# EAGLE design shinobi_BLE_Rev010001 (EAGLE 9.6.2)
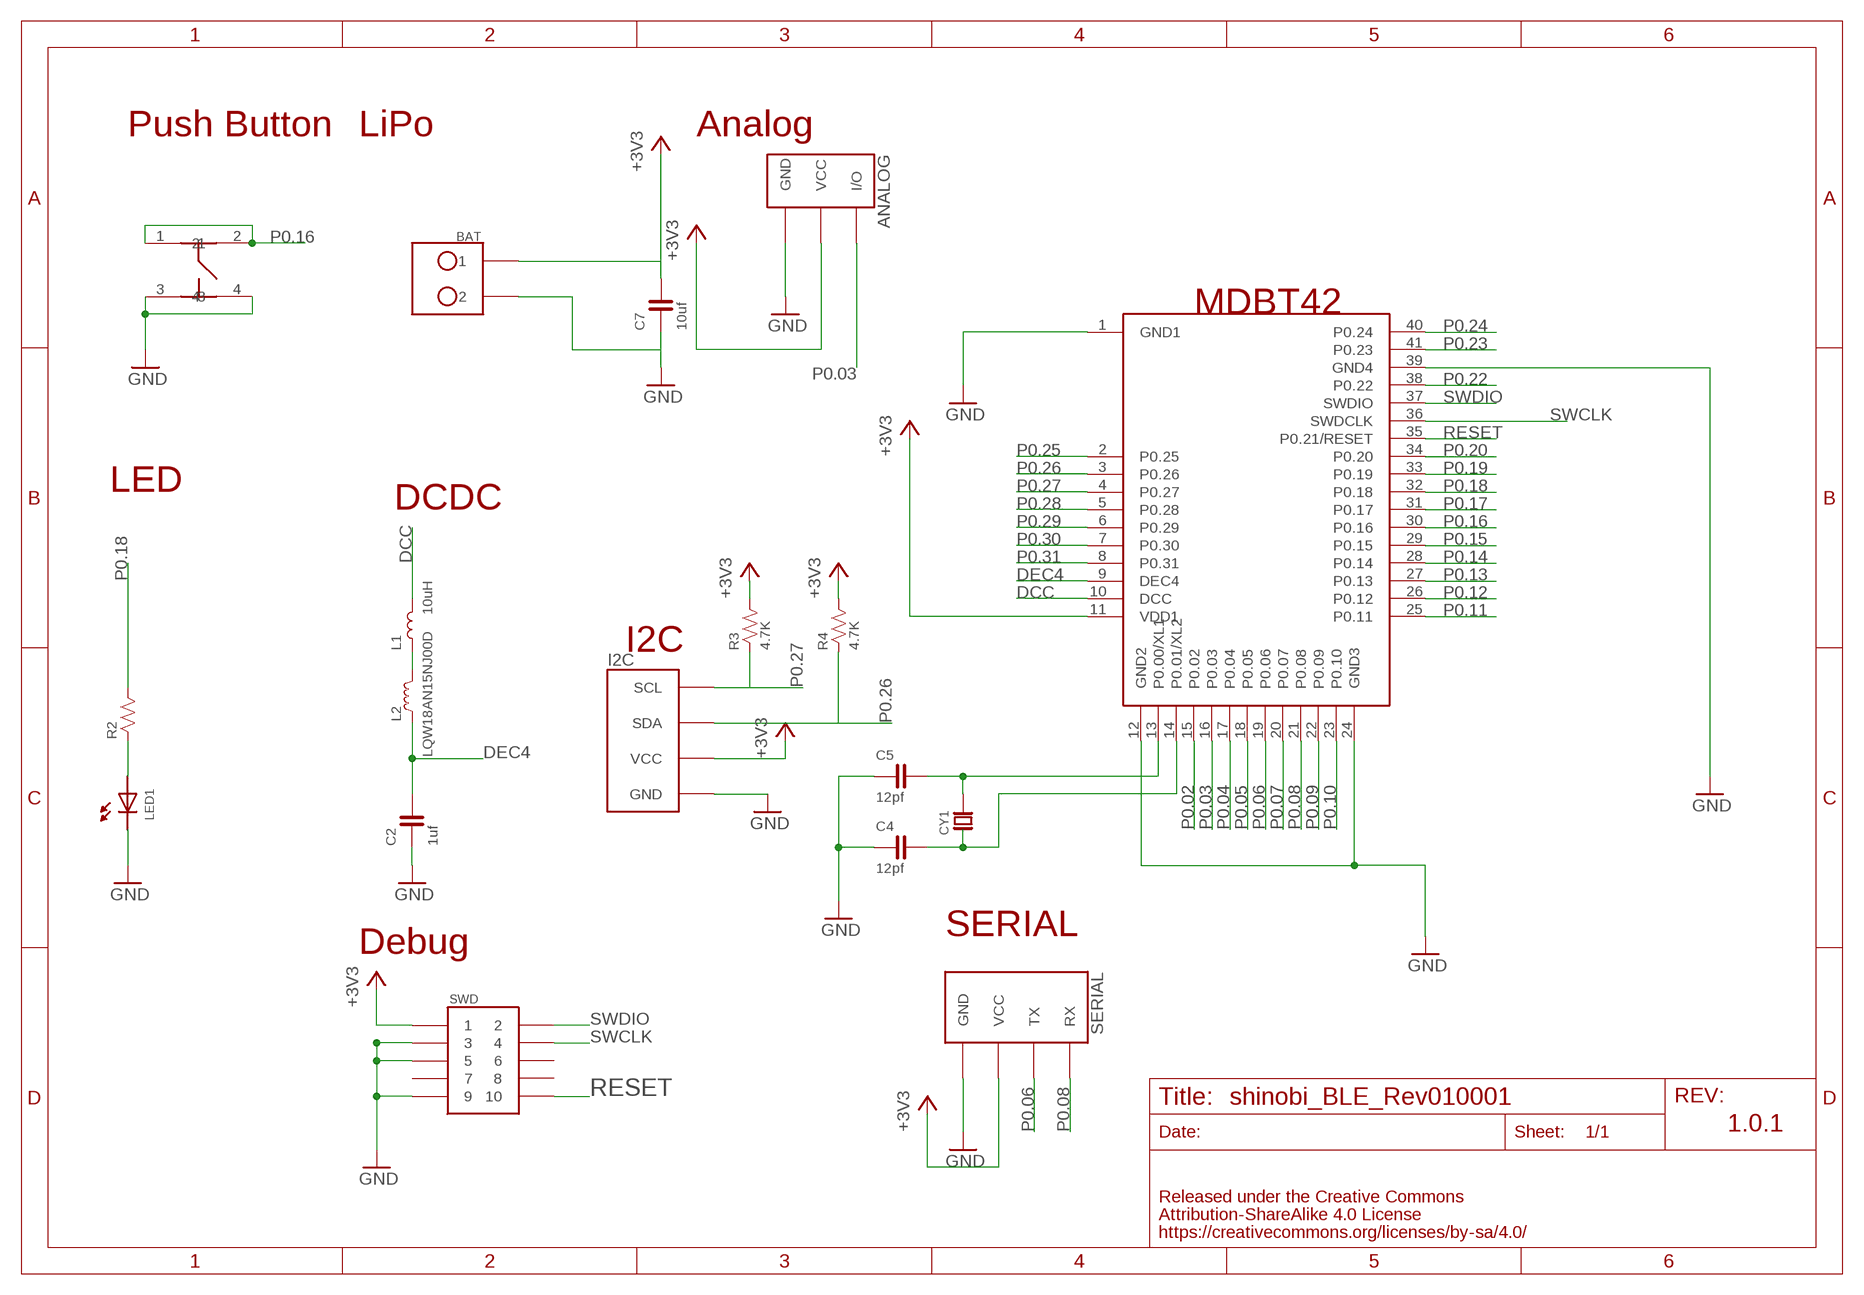
[diagram p0: schematic, sheet 1]

## Parts
ANALOG  FABO_BRICK_3PIN-S03B-PASK-2_LONG  [FABO_BRICK_3PIN_S03B-PASK-2_LONG]
BAT  S2B-PH-SM4_TB  [S2B-PH-SM4-TB]
C2  1uf  CAPACITOR-0603  [0603]
C4  12pf  CAPACITOR-0603  [0603]
C5  12pf  CAPACITOR-0603  [0603]
C7  10uf  CAPACITOR-0603  [0603]
CY1  CRYSTAL-ABS07  [ABRACON-ABS07-32.768KHZ]
I2C  FABO_BRICK_I2C-S04B-PASK-2_LONG  [FABO_BRICK_I2C_S04B-PASK-2_LONG]
L1  10uH  INDUCTOR-0603  [0603]
L2  LQW18AN15NJ00D  [0603]
LED1  LED-0603  [0603]
R2  RESISTOR-0603  [0603]
R3  4.7K  RESISTOR-0603  [0603]
R4  4.7K  RESISTOR-0603  [0603]
SERIAL  FABO_BRICK_SERIAL-S04B-PASK-2_LONG  [FABO_BRICK_SERIAL_S04B-PASK-2_LONG]
SWD  PIN-HEADER-SMT(1.27MM)2X5  [PIN-HEADER-SMT(1.27MM)2X5]
U$2  RAYTAC-MDBT42  [RAYTAC-MDBT42]
U$5  SWICTH-4P(KMR2)  [SWITCH-4P(KMR2)]

## Nets
+3V3: ANALOG.VCC BAT.2 C7.2 I2C.VCC R3.2 R4.2 SERIAL.VCC SWD.1 U$2.11(VDD1)
DCC: L1.2 U$2.10(DCC)
DEC4: C2.2 L2.1 U$2.9(DEC4)
GND: ANALOG.GND BAT.1 C2.1 C4.1 C5.1 C7.1 I2C.GND LED1.CATHODE SERIAL.GND SWD.3 SWD.5 SWD.9 U$2.1(GND1) U$2.12(GND2) U$2.24(GND3) U$2.39(GND4) U$5.3 U$5.4
N$1: LED1.ANODE R2.1
N$2: L1.1 L2.2
N$7: C5.2 CY1.P$2 U$2.13(P0.00/XL1)
N$8: C4.2 CY1.P$1 U$2.14(P0.01/XL2)
P0.02: U$2.15(P0.02)
P0.03: ANALOG.I/O U$2.16(P0.03)
P0.04: U$2.17(P0.04)
P0.05: U$2.18(P0.05)
P0.06: SERIAL.TX U$2.19(P0.06)
P0.07: U$2.20(P0.07)
P0.08: SERIAL.RX U$2.21(P0.08)
P0.09: U$2.22(P0.09)
P0.10: U$2.23(P0.10)
P0.11: U$2.25(P0.11)
P0.12: U$2.26(P0.12)
P0.13: U$2.27(P0.13)
P0.14: U$2.28(P0.14)
P0.15: U$2.29(P0.15)
P0.16: U$2.30(P0.16) U$5.1 U$5.2
P0.17: U$2.31(P0.17)
P0.18: R2.2 U$2.32(P0.18)
P0.19: U$2.33(P0.19)
P0.20: U$2.34(P0.20)
P0.22: U$2.38(P0.22)
P0.23: U$2.41(P0.23)
P0.24: U$2.40(P0.24)
P0.25: U$2.2(P0.25)
P0.26: I2C.SDA R4.1 U$2.3(P0.26)
P0.27: I2C.SCL R3.1 U$2.4(P0.27)
P0.28: U$2.5(P0.28)
P0.29: U$2.6(P0.29)
P0.30: U$2.7(P0.30)
P0.31: U$2.8(P0.31)
RESET: SWD.10 U$2.35(P0.21/RESET)
SWCLK: SWD.4 U$2.36(SWDCLK)
SWDIO: SWD.2 U$2.37(SWDIO)
Unconnected: SWD.6 SWD.7 SWD.8

## Notes on the sheet
- Push Button | LiPo | Analog
- MDBT42
- LED
- DCDC
- I2C
- SERIAL
- Debug
- 1.0.1

## Library data of the parts
ANALOG = FaBo-Template:FABO_BRICK_3PIN: FaBo Brick 3pin
BAT = FaBo-Connetor:S2B-PH-SM4_TB
C2 C4 C5 C7 = FaBo-Capacitor:CAPACITOR: CAPACITOR
CY1 = FaBo-Crystal:CRYSTAL
I2C = FaBo-Template:FABO_BRICK_I2C: FaBo Brick I2C
L1 = FaBo-Inductor:INDUCTOR: RESISTOR
L2 = FaBo-Coil:LQW18AN15NJ00D
LED1 = FaBo-LED:LED
R2-R4 = FaBo-Resistors:RESISTOR: RESISTOR
SERIAL = FaBo-Template:FABO_BRICK_SERIAL: FaBo Brick Serial
SWD = FaBo-PIN:PIN-HEADER-SMT(1.27MM)2X5
U$2 = FaBo-BT:RAYTAC-MDBT42
U$5 = gclue-test:SWICTH-4P(KMR2)

## Board
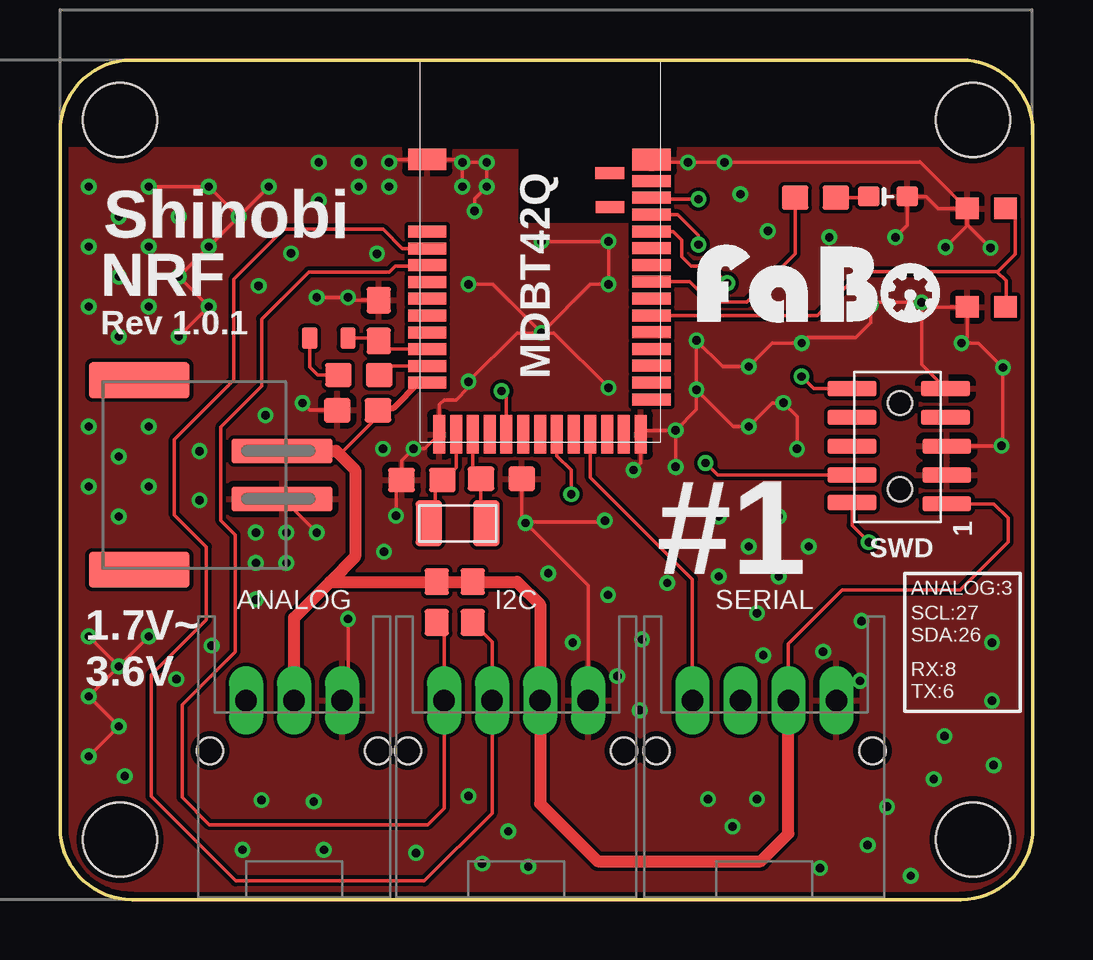
[diagram p1: board, top side]
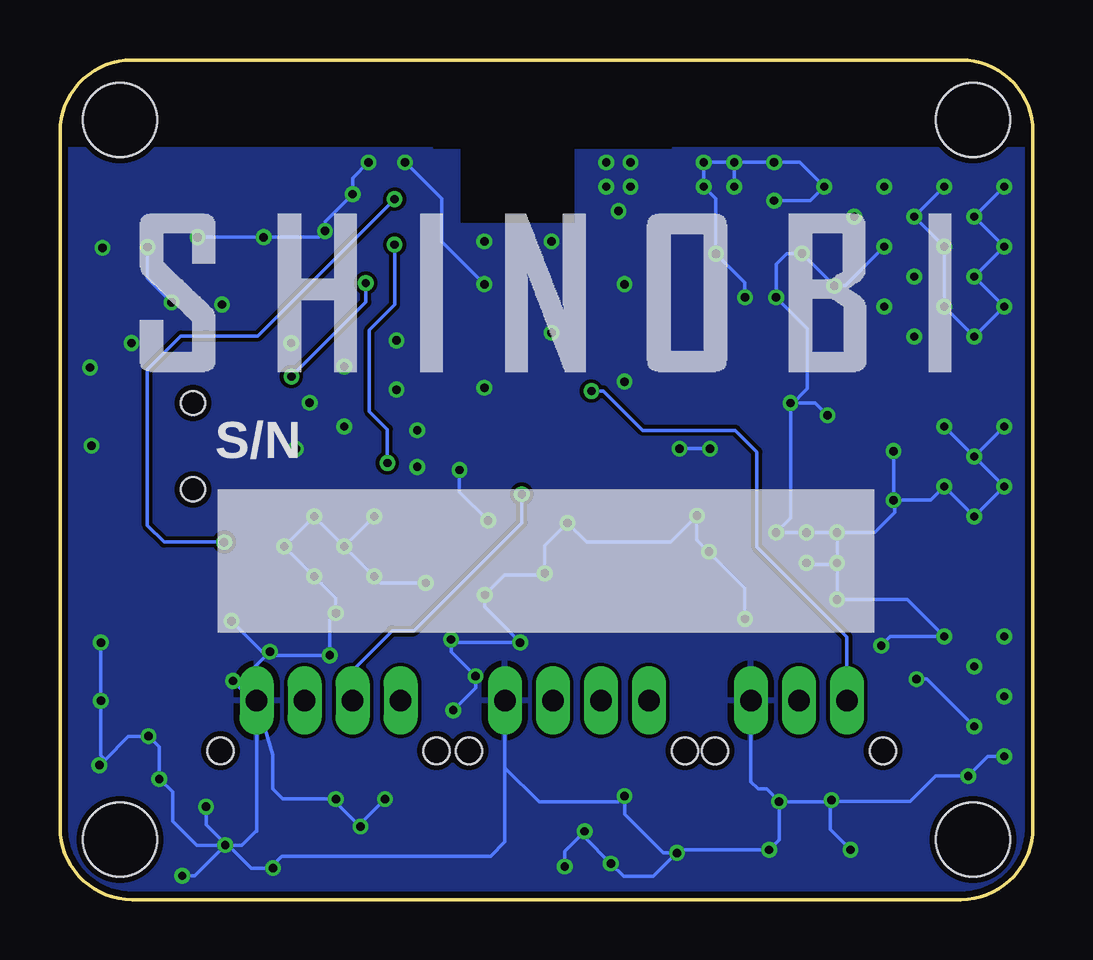
[diagram p2: board, bottom side, seen from below]

Size 40.54 x 35 mm. Coordinates in mm from the lower left corner, seen from the top.
Copper layers (1*16): Top 0.035mm / dielectric 1.5mm / Bottom 0.035mm
Design rules "SeeedStudio_2layer_DRU_no_angle_20140221": minimum track width 6mil, minimum drill 12mil, track to track 6mil, track to pad 6mil, pad to pad 6mil, via to via 6mil, smd to smd 0mil, copper to edge 10mil, drill to drill 10mil, minimum pad ring 10mil, minimum via ring 6mil, stop-mask expansion 2mil, vias tented up to drill 100mil, thermal gap 10mil
bKeepout: area 13.4,14.5 to 20.1,19.1

### Footprints (pad centres in the part's own frame; a part is rotated, then mirrored left to right if it is on the bottom)
FABO_BRICK_3PIN_S03B-PASK-2_LONG = drill 0.9 pad 1.422 long: GND -2,0; I/O 2,0; VCC 0,0 | hole 1.1: 3.5,2.1; -3.5,2.1
S2B-PH-SM4-TB = smd 1 x 4.2: 1 1,3.65; 2 -1,3.65 | smd 1.5 x 4.2: 3 -3.95,-2.3; 4 3.95,-2.3
0603 = smd 1.1 x 1: 1 -0.85,0; 2 0.85,0
ABRACON-ABS07-32.768KHZ = smd 1.1 x 1.9: P$1 -1.2,0; P$2 1.2,0
FABO_BRICK_I2C_S04B-PASK-2_LONG = drill 0.9 pad 1.422 long: GND -3,0; SCL 3,0; SDA 1,0; VCC -1,0 | hole 1.1: 4.5,2.1; -4.5,2.1
0603' = smd 0.65 x 0.9: 1 -0.8,0; 2 0.8,0
0603'' = smd 0.9 x 0.8: ANODE -0.8,0; CATHODE 0.8,0
FABO_BRICK_SERIAL_S04B-PASK-2_LONG = drill 0.9 pad 1.422 long: GND -3,0; RX 3,0; TX 1,0; VCC -1,0 | hole 1.1: 4.5,2.1; -4.5,2.1
PIN-HEADER-SMT(1.27MM)2X5 = smd 0.635 x 2.032: 1 -2.4,-1.95; 2 -2.35,2; 3 -1.2,-1.95; 4 -1.2,2; 5 0,-1.95; 6 0,2; 7 1.2,-1.9; 8 1.2,2; 9 2.4,-1.9; 10 2.4,2 | hole 1: 1.8,0; -1.8,0
FABO-SHINOBI = hole 3.1: 2.5,32.5; 38.04,32.5; 38.04,2.5; 2.5,2.5
RAYTAC-MDBT42 = smd 1.6 x 0.9: 1 -4.7,3.8; 39 4.65,3.79 | smd 1.6 x 0.5: 2 -4.7,0.79; 3 -4.7,0.09; 4 -4.7,-0.61; 5 -4.7,-1.31; 6 -4.7,-2.01; 7 -4.7,-2.71; 8 -4.7,-3.41; 9 -4.7,-4.11; 10 -4.7,-4.81; 11 -4.7,-5.51; 25 4.65,-6.2; 26 4.65,-5.5; 27 4.65,-4.8; 28 4.65,-4.1; 29 4.65,-3.4; 30 4.65,-2.7; 31 4.65,-2; 32 4.65,-1.3; 33 4.65,-0.6; 34 4.65,0.1; 35 4.65,0.8; 36 4.65,1.5; 37 4.65,2.2; 38 4.65,2.9 | smd 0.5 x 1.6: 12 -4.2,-7.66; 13 -3.5,-7.66; 14 -2.8,-7.66; 15 -2.1,-7.66; 16 -1.4,-7.66; 17 -0.7,-7.66; 18 0,-7.66; 19 0.7,-7.66; 20 1.4,-7.66; 21 2.1,-7.66; 22 2.8,-7.66; 23 3.48,-7.66; 24 4.2,-7.66 | smd 1.2 x 0.5: 40 2.91,3.23; 41 2.92,1.81
SWITCH-4P(KMR2) = smd 0.9 x 0.95: 1 -1,0; 2 3.1,0; 3 -1,-1.6; 4 3.1,-1.6

### Placement (x,y rotation side)
ANALOG  9.75,8.3 180 top
BAT  5.6,17.7 270 top
C2  13.28,24.14 270 top
C4  18.39,17.54 180 top
C5  15.08,17.49 0 top
C7  12.4,20.4 0 top
CY1  16.57,15.69 180 top
I2C  19,8.3 180 top
L1  12.45,21.87 0 top
L2  LQW18AN15NJ00D  [0603']  11.2,23.4 180 top
LED1  [0603'']  34.5,29.31 0 top
R2  31.48,29.26 180 top
R3  15.7,12.4 90 top
R4  17.2,12.4 90 top
SERIAL  29.35,8.3 180 top
SWD  35,18.9 90 top
U$1  [FABO-SHINOBI]  0,0 0 top
U$2  20,27.05 0 top
U$5  39.4,27.81 270 top
U$7  [LOGO_FABO_M]  31.62,23.68 0 top

### Tracks (layer width: path | path; a pad name or v marks a point on that pad's centre or on a via)
+3V3
  Top 0.152: C7.2 13.25,20.07 | 13.18,20.33 C7.2 | BAT.2 9.35,18.8 | 15.19,21.49 15.24,21.49 U$2.11 15.04,21.54 | SERIAL.VCC 30.35,10.65 32.6,12.9 37.5,12.9 39.5,14.9 39.5,15.9 38.9,16.5 SWD.1 | C7.2 12.95,20.1 | C7.2 13.25,20.15 11.8,18.7 11.5,18.7
  Top 0.254: 13.25,20.25 C7.2 13.35,20.5 13.9,20.5 14.94,21.54 U$2.11
  Top 0.5: ANALOG.VCC 9.75,11.75 | 20,12.3 I2C.VCC 20,4 22.4,1.6 29.2,1.6 30.35,2.75 SERIAL.VCC
  Top 0.508: 20,12.3 19.05,13.25 R4.2 R3.2 11.25,13.25 | 9.75,11.75 11.25,13.25 | BAT.2 11.5,18.7 12.3,17.9 12.3,14.3 11.25,13.25
DCC
  Top 0.152: 13.38,21.9 L1.2 13.67,22.24 U$2.10 15.24,22.1
DEC4
  Top 0.152: 15.24,23.01 U$2.9 13.63,22.94 C2.2 13.17,23.4 L2.1
GND  (via drill 0.35)
  Top 0.152: 37.68,28.7 37.79,28.8 | 37.79,28.8 U$5.3 | U$2.39 24.69,30.79 24.74,30.73 v26.16,30.73 v27.69,30.73 35.81,30.73 35.83,30.75 37.79,28.8 | 11.5,20.33 C7.1 10.4,20.4 v10.1,20.7 | 24.23,19.51 U$2.24 | C5.1 14.23,17.57 14.23,18.29 v14.73,18.8 15.2,18.8 U$2.12 | U$2.12 15.7,19.36 | 14.08,17.42 C5.1 | 35.37,29.21 LED1.CATHODE | 15.24,30.94 15.26,30.91 U$2.1 | 35.22,29.37 LED1.CATHODE | LED1.CATHODE 36.09,29.31 36.6,28.8 U$5.3 | U$5.3 37.8,28.1 v36.9,27.2 | v35.9,24.9 33.89,24.9 v33.79,24.8 33.79,24.06 33.15,23.42 31.13,23.42 v30.91,23.2 29.68,23.2 v28.7,22.22 27.61,22.22 v26.52,23.31 v26.52,21.26 | v35.9,24.9 35.9,22.3 SWD.9 | C5.1 14,17.26 v14,16 | 19.35,15.75 v19.4,15.7 22,13.1 I2C.GND | 19.35,15.75 19.24,15.86 C4.1 | v10.7,15.3 9.3,16.7 BAT.1 | U$2.24 24.2,18.21 v23.9,17.91 | v22.7,15.8 22.65,15.75 19.35,15.75 | C2.1 12.11,24.99 v12,25.1 v10.7,25.1 | U$2.1 13.83,30.85 v13.72,30.73 | U$2.1 16.65,30.85 v16.76,30.73 | v16.76,30.73 v17.78,30.73 v17.78,29.72 17.27,29.21 v17.27,28.7 | v16.76,29.72 v16.76,30.73 | U$2.12 15.8,20.63 16,20.83 16.51,20.83 17.02,21.34 v17.02,21.59 19.05,23.62 v20.07,23.62 | v17.02,25.65 18.03,25.65 v20.07,23.62 | v20.07,23.62 22.1,25.65 v22.86,25.65 v22.86,27.43 v20.07,27.43 | v22.86,21.34 20.57,23.62 v20.07,23.62 | U$2.24 24.37,19.56 v25.65,19.56 | v25.65,19.56 v25.65,18.03 | v35.9,24.9 36.09,24.71 U$5.4 37.8,23.44 v37.56,23.2 38.27,23.2 v39.29,22.18 39.29,18.98 v39.23,18.91 39.21,18.9 SWD.5 | v3.7,29.72 v6.2,29.72 v7.45,28.47 | v7.45,28.47 v6.2,27.22 v4.95,25.97 v6.2,24.72 v4.95,23.47 | v7.45,28.47 v8.7,29.72 | v25.65,19.56 26.52,20.42 v26.52,21.26 | v26.52,21.26 28.06,19.72 v28.7,19.72 29.68,20.7 v30.14,20.7 30.71,20.13 v30.71,18.78
  Top 0.152: v1.2,10.97 v2.45,9.72 | v2.45,9.72 v3.7,10.97 | v2.45,9.72 v1.2,8.47 v2.45,7.22 v1.2,5.97 | LED1.CATHODE 35.3,28.11 v34.81,27.61 | v38.77,27.16 37.79,28.15 37.79,28.8 | v12,11.7 12,8.55 ANALOG.GND
  Bottom 0.152: v36.9,27.2 36.9,25.9 v35.9,24.9 | 10.1,20.6 v10.1,20.7 9.08,20.7 v8.56,20.19 | 10.1,20.6 10.1,15.9 v10.7,15.3 v9.43,15.3 v8.16,15.3 | v23.9,17.91 23.9,17 v22.7,15.8 | v10.7,25.1 10.69,25.09 | 10.69,25.09 9.4,23.8 9.4,21.3 10.1,20.6 | 22,5.49 22,2.4 22.6,1.8 31.3,1.8 31.67,1.43 v31.67,1.31 32.58,1.31 33.54,2.27 | 32.35,2.85 32.35,2.88 | 32.35,2.88 SERIAL.GND | 8.16,13.97 v8.16,12.51 5.23,12.51 v3.7,10.97 5.94,10.97 v6.32,10.58 | 8.16,13.97 v8.16,14.03 v8.16,15.3 | v9.43,14.03 9.37,13.97 8.16,13.97 | v12,25.1 12,25.72 v13.21,26.92 13.21,29.21 v13.72,29.72 v13.72,30.73 v12.45,30.73 | 22,5.49 20.57,4.06 17.27,4.06 v17.02,4.32 17.02,3.56 15.41,1.94 v14.83,1.94 | 22,5.49 I2C.GND | v13.46,18.8 v14.73,18.8 | v12.45,30.73 v12.45,29.72 | v26.16,30.73 24.64,29.21 24.64,27.43 v22.86,25.65 | v10.57,4.08 11.1,4.61 11.46,4.61 11.75,4.9 ANALOG.GND | v10.57,4.08 8.46,4.08 8.45,4.1 | 8.45,4.1 v8.4,4.15 | v8.16,15.3 6.59,15.3 5.76,16.13 5.76,16.6 v5.81,16.65 | v5.81,16.65 v5.81,18.69 | v5.81,16.65 4.27,16.65 v3.7,17.22 v2.45,15.97 v1.2,17.22 v2.45,18.47 | v2.45,18.47 v3.7,19.72 | v2.45,18.47 v1.2,19.72 | v2.45,23.47 2.43,23.48 | 2.43,23.48 v1.2,24.72 v2.45,25.97 v1.2,27.22 v2.45,28.47 v1.2,29.72 | v3.7,29.72 v4.95,28.47 v3.7,27.22 v3.7,24.72 2.46,23.48 2.43,23.48 | v6.2,27.22 7.83,25.59 v8.28,25.59 v9.62,26.93 10.25,26.93 10.69,26.5 10.69,25.09 | v12.45,30.73 v10.78,30.73 9.71,30.73 v8.7,29.72 9.28,29.13 v10.78,29.13 | v2.45,7.22 4.42,9.19 v4.85,9.19 | v7.6,2.07 8.45,2.92 8.45,4.1 | v10.57,4.08 10.57,2.49 v10.99,2.07 14.7,2.07 v14.83,1.94 | v19.51,1.37 19.51,2.01 v18.68,2.84 18.68,2.59 v17.59,1.5 17.05,0.96 15.82,0.96 v14.83,1.94
  Bottom 0.152: v24.15,7.89 23.22,8.82 v23.22,9.31 24.25,10.33 v24.25,10.84 24.12,10.72 v21.37,10.72 22.84,12.19 v22.84,12.7 22.02,13.52 20.27,13.52 v20.34,13.6 20.34,14.76 v19.4,15.7 18.6,14.9 15.1,14.9 v14,16 14,15 v13.5,14.5 | v27,4.19 28.02,3.16 v28.02,3.04 29.05,4.06 v29.05,4.19 31.26,4.19 31.68,4.61 31.68,6.03 SERIAL.GND | 32.35,2.88 32.96,2.27 33.54,2.27 | 33.54,2.27 33.6,2.27 | 33.6,2.27 v33.65,2.27 | v33.65,2.27 34.93,0.99 v35.45,0.99 | v33.65,2.27 34.84,2.27 35.84,3.26 35.84,4.48 36.38,5.02 v36.41,5.02 36.41,6.36 v36.85,6.81 37.69,6.81 38.66,5.83 | 38.66,5.83 v38.9,5.6 | 38.66,5.83 38.84,6.01 v38.84,8.28 v38.84,10.72 | SERIAL.GND 32.35,8.13 v33.33,9.12 33.01,9.12 v31.8,10.33 | v31.8,10.33 32.12,10.33 v33.4,11.61 | v31.8,10.33 31.65,10.18 v29.3,10.18 29.3,11.68 v29.05,11.93 29.05,12.57 v29.95,13.47 v31.2,14.72 v29.95,15.97 v28.7,14.72 | v28.7,14.72 v27.45,15.97 | v28.7,14.72 v27.45,13.47 27.18,13.2 v25.3,13.2 | v27.69,30.73 28.35,30.07 v28.35,29.41 29.49,28.26 v29.49,27.87 29.75,27.61 v32.05,27.61 v34.81,27.61 | 13.4,14.5 v13.5,14.5 | v13.5,14.5 12,13 v12,11.7 | v1.2,5.97 1.88,5.97 v2.7,5.15 4.05,5.15 5.1,4.1 8.45,4.1 | v34.45,3.87 34.45,3.12 33.6,2.27
  pour Bottom: -0.8,0 -0.8,31.3 41.8,31.3 41.8,0
  pour Top: -1,0 -1,31.3 42,31.3 42,0
N$1
  Top 0.152: 33.7,29.21 LED1.ANODE 33.57,29.18 33.5,29.26 R2.1
N$2
  Top 0.152: 11.43,21.7 L1.1 10.73,21.87 10.4,22.2 L2.2
N$7
  Top 0.152: C5.2 16.06,17.57 16.5,18.01 U$2.13 16.46,19.36 | 15.45,15.73 CY1.P$2 15.63,15.95 15.63,17.19 C5.2 | 15.91,17.42 C5.2
N$8
  Top 0.152: C4.2 17.59,17.42 17.2,17.81 U$2.14 17.22,19.36 | 17.89,15.73 CY1.P$1 | CY1.P$1 | 17.44,17.57 C4.2 | C4.2 17.54,15.93 CY1.P$1
P0.03  (via drill 0.35)
  Top 0.152: 18.59,19.51 U$2.16 18.6,21 v18.4,21.2
  Bottom 0.152: ANALOG.I/O 7.75,10.95 11.5,14.7 11.5,18.66 12.4,19.56 16.26,19.56 17.9,21.2 v18.4,21.2
P0.06  (via drill 0.35)
  Top 0.152: 20.57,19.36 U$2.19 20.7,18.5 21.3,17.9 v21.3,16.9
  Bottom 0.152: SERIAL.TX 28.35,9.55 26.7,11.2 25.8,11.2 21.3,15.7 v21.3,16.9
P0.08
  Top 0.152: U$2.21 22.25,19.36 22.1,19.2 22.1,17.6 26.35,13.35 SERIAL.RX
P0.09
  Top 0.152: 22.71,19.51 U$2.22
P0.10
  Top 0.152: 23.62,19.36 U$2.23
P0.16
  Top 0.152: 39.32,24.69 39.38,24.7 | 39.38,24.7 U$5.2 | U$2.30 31.55,24.35 33.38,26.18 39.04,26.18 39.06,26.16 | 39.06,26.16 39.42,25.79 39.42,24.74 39.38,24.7 | U$5.1 39.8,28.4 39.8,26.9 39.06,26.16
P0.18
  Top 0.152: 24.54,25.76 U$2.32 26.25,25.75 27.1,24.9 28.61,24.9 30.63,26.92 R2.2
P0.26
  Top 0.152: 17.34,11.5 R4.1 | 15.39,27.13 U$2.3 14.26,27.14 13.46,27.94 9.32,27.94 7.24,25.86 7.24,21.66 4.77,19.18 4.77,16.03 6.1,14.7 6.1,11.66 3.8,9.36 3.8,4.3 7.32,0.78 15.18,0.78 18,3.6 I2C.SDA 18,10.75 R4.1 | 17.19,11.65 R4.1
P0.27
  Top 0.152: 15.39,26.36 U$2.4 15.27,26.42 13.97,26.42 13.72,26.16 10.36,26.16 8.4,24.2 8.4,21.4 6.7,19.7 6.7,15.8 7.3,15.2 7.3,10.32 5.09,8.12 5.09,4.25 6.23,3.12 15.32,3.12 16,3.8 I2C.SCL 16,11.25 R3.1
RESET  (via drill 0.35)
  Top 0.152: SWD.10 31.4,21.3 v30.9,21.8 | v27.8,25.7 27.1,26.4 26.3,26.4 25.9,26.8 25.9,27.5 25.55,27.85 U$2.35
  Bottom 0.152: v30.9,21.8 27.8,24.9 v27.8,25.7
SWCLK  (via drill 0.35)
  Top 0.152: 24.69,28.65 U$2.36 25.75,28.55 26.6,27.7 v26.6,27.3 | SWD.4 27.4,17.7 v26.9,18.2
  Bottom 0.152: v26.9,18.2 26.9,19.6 27.65,20.35 27.65,23.74 26.6,24.79 v26.6,27.3
SWDIO  (via drill 0.35)
  Top 0.152: 24.69,29.26 U$2.37 24.7,29.2 v26.6,29.2 | SWD.2 33,15.6 v33.7,14.9
  Bottom 0.152: v26.6,29.2 32.3,23.5 34.4,23.5 34.5,23.5 35.5,23.5 36.9,22.1 36.9,15.6 36.2,14.9 v33.7,14.9

### Text on the board
tPlace: Shinobi | NRF | Rev 1.0.1 | MDBT42Q | #1 | ANALOG:3 | SCL:27 / SDA:26 | 1.7V~ / 3.6V | RX:8 / TX:6
bPlace: S/N
Document: Shinobi NRF / Rev1.0.1 / 2022/10/22